# Altium schematic sheet main_connector.SchDoc: X
size A4; Date: DD-MM-YYYY; CheckedBy: X; DrawnBy: Y; Revision: 0.0.0; SheetNumber: X; SheetTotal: Y; Projectnumber: OWN-000; Size: A4; Projectname: X
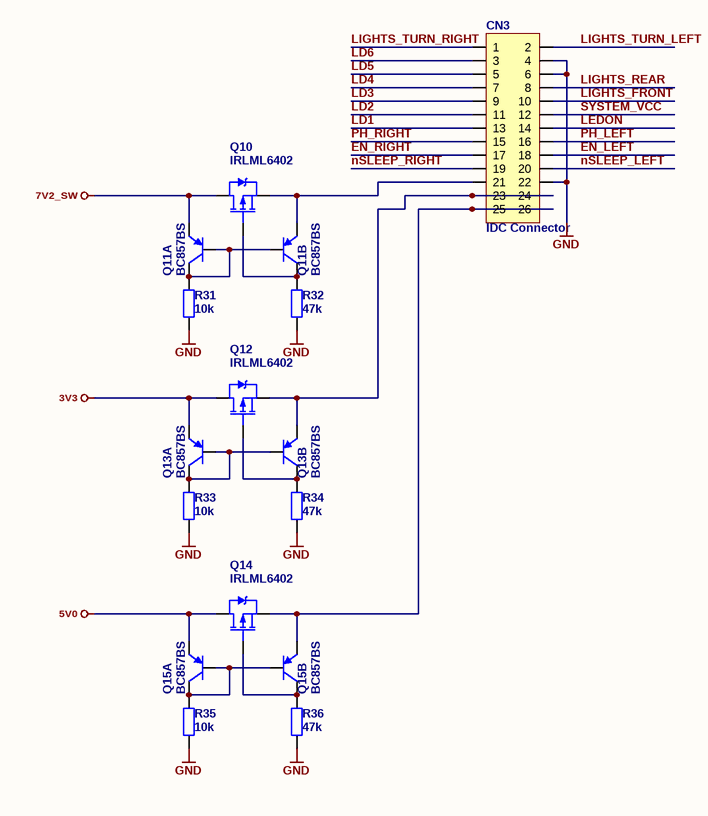
[diagram p0: main_connector.SchDoc]

## Parts
CN3  IDC Connector  [IDC26_RA_LONG_W_CN]
Q10  IRLML6402  [SOT-23]
Q11  BC857BS  [SOT-323-6 (SOT-363, SC88, SC70-6)]  (parts A,B of 2)
Q12  IRLML6402  [SOT-23]
Q13  BC857BS  [SOT-323-6 (SOT-363, SC88, SC70-6)]  (parts A,B of 2)
Q14  IRLML6402  [SOT-23]
Q15  BC857BS  [SOT-323-6 (SOT-363, SC88, SC70-6)]  (parts A,B of 2)
R31  10k  [R0805]
R32  47k  [R0805]
R33  10k  [R0805]
R34  47k  [R0805]
R35  10k  [R0805]
R36  47k  [R0805]

## Nets
3V3: Q12.3(D) Q13.1(EA)
5V0: Q14.3(D) Q15.1(EA)
7V2_SW: Q10.3(D) Q11.1(EA)
GND: CN3.4 CN3.6 CN3.22 R31.1 R32.1 R33.1 R34.1 R35.1 R36.1
EN_LEFT: CN3.18
EN_RIGHT: CN3.17
LD1: CN3.13
LD2: CN3.11
LD3: CN3.9
LD4: CN3.7
LD5: CN3.5
LD6: CN3.3
LEDON: CN3.14
LIGHTS_FRONT: CN3.10
LIGHTS_REAR: CN3.8
LIGHTS_TURN_LEFT: CN3.2
LIGHTS_TURN_RIGHT: CN3.1
nSLEEP_LEFT: CN3.20
nSLEEP_RIGHT: CN3.19
PH_LEFT: CN3.16
PH_RIGHT: CN3.15
SYSTEM_VCC: CN3.12
NetCN3_21: CN3.21 Q10.2(S) Q11.4(EB)
NetCN3_23: CN3.23 CN3.24 Q12.2(S) Q13.4(EB)
NetCN3_25: CN3.25 CN3.26 Q14.2(S) Q15.4(EB)
NetQ10_1: Q10.1(G) Q11.3(CB) R32.2
NetQ11_2: Q11.2(BA) Q11.5(BB) Q11.6(CA) R31.2
NetQ12_1: Q12.1(G) Q13.3(CB) R34.2
NetQ13_2: Q13.2(BA) Q13.5(BB) Q13.6(CA) R33.2
NetQ14_1: Q14.1(G) Q15.3(CB) R36.2
NetQ15_2: Q15.2(BA) Q15.5(BB) Q15.6(CA) R35.2

## Notes on the sheet
- PROJECT NAME:
- PROJECT NO.:
- DATE:
- TITLE:
- SHEET
- of
- DRAWN BY:
- REVISION:
- FILENAME:
- A4

## Library data of the parts
CN3 = CN_13x2
Q10 Q12 Q14 = IRLML6402: P-Channel; -20V, -3.7A, 1.3W; HEXFET Power MOS-FET
Q11 Q13 Q15 = BC857BS: 2xPNP General Purpose Transistor (VCE=-45V, IC=-100mA)
R31-R36 = Res: Resistor; Published: 19-Feb-2006; ComponentLink1Description: datasheet; ComponentLink2Description: supplier
  R31 R33 R35: Value: 10k
  R32 R34 R36: Value: 47k